# Altium schematic sheet rele.SchDoc
size 209 x 297 mm; Scale: 1:1; Разраб.: Иванов; Обозначение документа: АБВГ.123456.001 Э3; Пров.: Петров; Утв.: Сидоров; Наименование организации: ОАО "Концерн "МПО-Гидроприбор"; Перв. применение: АБВГ.123456.000; Наименование изделия 1: Плата; Наименование изделия 2: Схема электрическая; Наименование изделия 3: принципиальная; Нач. отд.: Нач. отд.; Фамилия нач. отд.: Сидоров
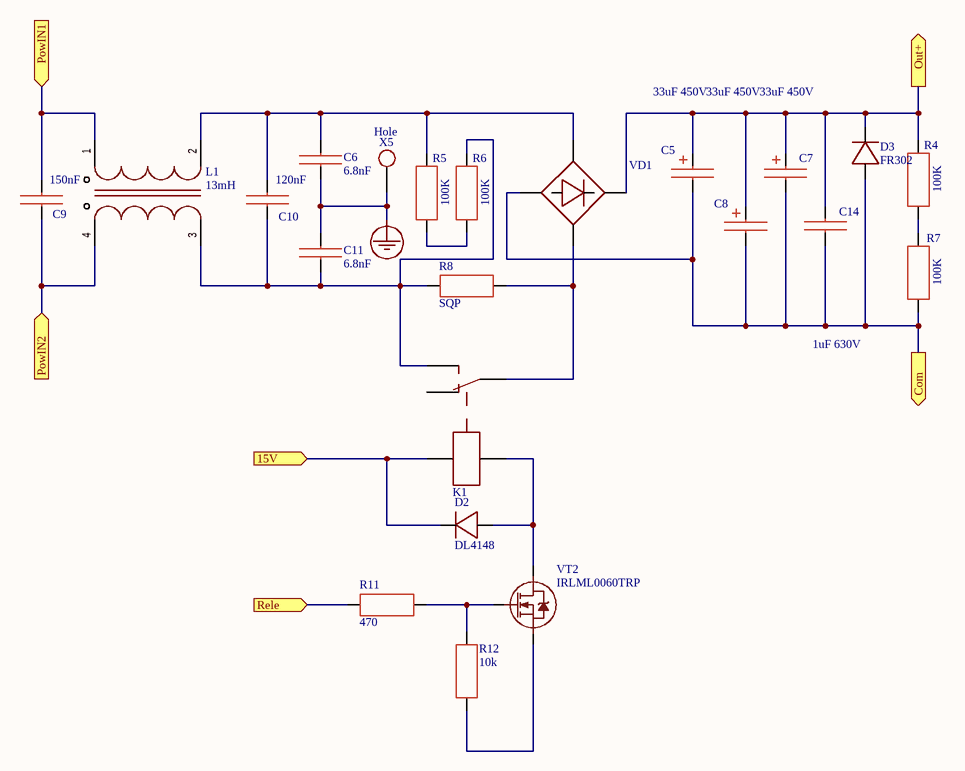
[diagram p0: rele.SchDoc]

## Parts
C5  33uF 450V  [D16_F7.5_d0.8_31.5]
C6  6.8nF  [10_5_11_13]
C7  33uF 450V  [D16_F7.5_d0.8_31.5]
C8  33uF 450V  [D16_F7.5_d0.8_31.5]
C9  150nF  [case M]
C10  120nF  [case M]
C11  6.8nF  [10_5_11_13]
C14  1uF 630V  [29_22,5_13,5_27,5_0,8]
D2  DL4148  [DL-35]
D3  FR302  [DO-27-V]
K1  Relay  [1C]  (value not drawn)
L1  13mH  [PLA10]
R4  100K  [RC1206]
R5  100K  [RC1206]
R6  100K  [RC1206]
R7  100K  [RC1206]
R8  SQP  [5W]
R11  470  [RC0805_3D]
R12  10k  [RC0805_3D]
VD1  KBU1010  [KBU]  (value not drawn)
VT2  IRLML0060TRP  [SOT23]
X5  Hole  [Round_3x1.2]

## Ports
15V (in), Com (out), Out+ (out), PowIN1 (in), PowIN2 (in), Rele (in)

## Nets
GND_B: C6.1 C11.2 X5.1
15V: D2.1 K1.1 ; port 15V
Com: C5.2 C7.2 C8.2 C14.2 D3.1(A) R7.1 VD1.4 ; port Com
Out+: C5.1 C7.1 C8.1 C14.1 D3.2(K) R4.2 VD1.1 ; port Out+
PowIN1: C9.2 L1.1 ; port PowIN1
PowIN2: C9.1 L1.4 ; port PowIN2
Rele: R11.2 ; port Rele
NetC6_2: C6.2 C10.2 L1.2 R5.2 VD1.3
NetC10_1: C10.1 C11.1 K1.3 L1.3 R6.2 R8.1
NetD2_2: D2.2 K1.4 VT2.3
NetK1_5: K1.5 R8.2 VD1.2
NetR4_1: R4.1 R7.2
NetR5_1: R5.1 R6.1
NetR11_1: R11.1 R12.1 VT2.1
NetR12_2: R12.2 VT2.2

Not connected (* = marked no-connect by the designer): K1 2

## Notes on the sheet
- Перв. примен.
- Справ. №
- Подп. и дата
- Инв. № дубл.
- Взам. инв. №
- Инв. № подл.
- Изм.
- Лист
- № докум.
- Подп.
- Дата
- Копировал

## Library data of the parts
C6 C11 = B32021-10mm-6.8nF
C9 C10 = MKP63 case_M
  C9: value: 150nF
  C10: value: 120nF
K1 = 833H
L1 = PLA10AS1330R5D2B
R4-R7 = RC1206 X Ohm: Value: 100K
R11 R12 = RC0805 X Ohm
  R11: Value: 470
  R12: Value: 10k